# EAGLE schematic midi3.3v-1 (EAGLE 6.6.0)
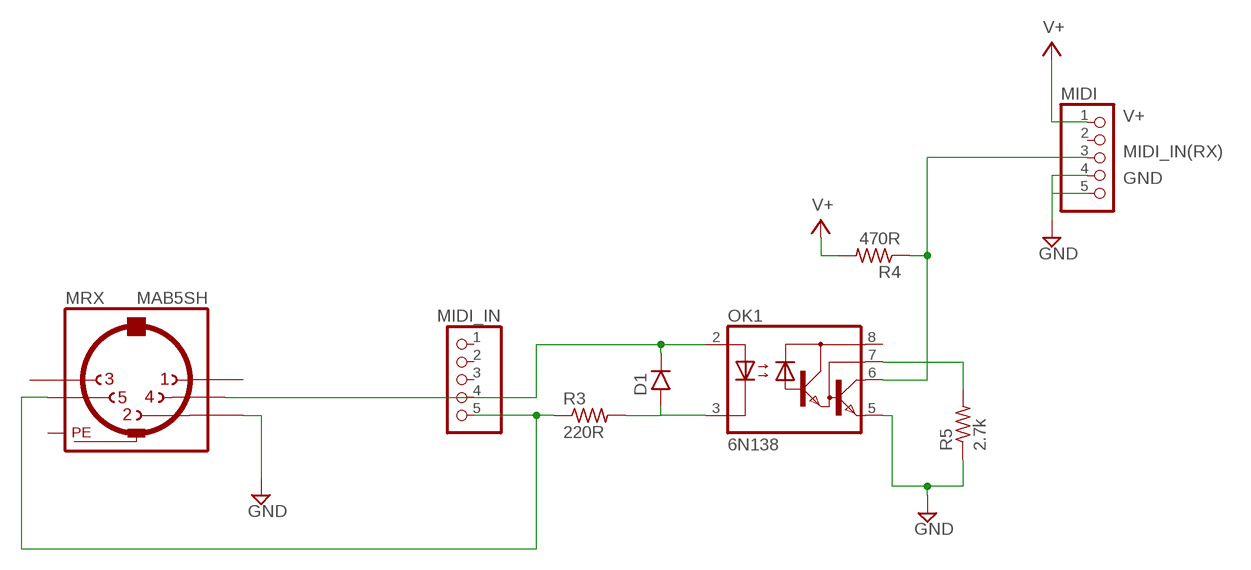
[diagram p0: schematic, sheet 1]

## Parts
D1  1N4148-2  [DO35-2]
MIDI  PINHD-1X5  [1X05]
MIDI_IN  PINHD-1X5  [1X05]
MRX  MAB5SH  [MAB5SH]
OK1  6N138  [DIL08]
R3  220R  6MM.3  [R0207/3]
R4  470R  6MM.3  [R0207/3]
R5  2.7k  6MM.3  [R0207/3]

## Nets
GND: MIDI.4 MIDI.5 MRX.2 OK1.5(GND) R5.1
MIDI_IN(RX): MIDI.3 OK1.6(VO) R4.1
N$3: MIDI_IN.5 MRX.5 R3.1
N$4: D1.A OK1.3(C) R3.2
N$5: D1.C MIDI_IN.4 MRX.4 OK1.2(A)
N$7: OK1.7(VB) R5.2
V+: MIDI.1 R4.2
Unconnected: MIDI.2 MIDI_IN.1 MIDI_IN.2 MIDI_IN.3 MRX.1 MRX.3 OK1.8(VCC)

## Power pins joined to a net without a drawn wire
PE: MRX.PE MRX.PE@(PE)

## Library data of the parts
D1 = gm-diodes:1N4148: Fast Switching Diode DO-35 glass case a.k.a. 1N914
MIDI MIDI_IN = pinhead:PINHD-1X5: PIN HEADER
MRX = jaapie:MAB5SH: Female CONNECTOR 5 pins 90 deg. with shield, horizontal (DIN 41524); OC_FARNELL: 809883; OC_NEWARK: unknown
OK1 = optocoupler:6N138: MOTOROLA OPTO COUPLER; MF: VISHAY/TELEFUNKEN; MPN: 6N138; OC_FARNELL: 9860150; OC_NEWARK: 35K5294
R3-R5 = gm-resistors:6MM: 6mm Resistors Leads spaced 1-6 holes apart for 0.1" perfboard. Suitable for 1/4 watt resistors.